# Altium schematic sheet BSPD_Simulation.SchDoc: QUTMS Shutdown V2 - BSPD_Simulation
size A4; Author: Jonn Dillon; Organization: QUT Motorsport; Address1: O-120; Address2: O Block; Address3: QUT Gardens Point; Address4: Brisbane, 4000; DocumentNumber: 10; SheetNumber: 10; SheetTotal: 13
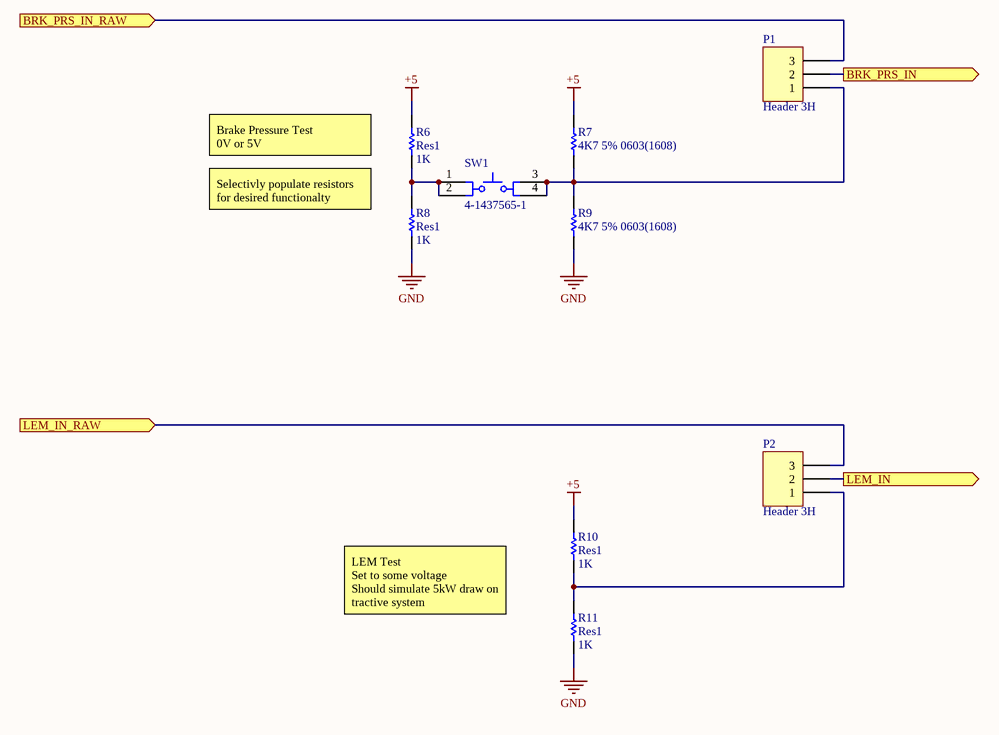
[diagram p0: BSPD_Simulation.SchDoc]

## Parts
P1  Header 3H  [HDR1X3H]
P2  Header 3H  [HDR1X3H]
R6  Res1  value 1K  [AXIAL-0.3]
R7  4K7 5% 0603(1608)  [RESC0603(1608)_N]
R8  Res1  value 1K  [AXIAL-0.3]
R9  4K7 5% 0603(1608)  [RESC0603(1608)_N]
R10  Res1  value 1K  [AXIAL-0.3]
R11  Res1  value 1K  [AXIAL-0.3]
SW1  4-1437565-1  [TECO-4-1437565-1_V]

## Ports
BRK_PRS_IN (out), BRK_PRS_IN_RAW (in), LEM_IN (out), LEM_IN_RAW (in)

## Nets
+5: R6.2 R7.2 R10.2
GND: R8.1 R9.1 R11.1
BRK_PRS_IN: P1.2 ; port BRK_PRS_IN
BRK_PRS_IN_RAW: P1.3 ; port BRK_PRS_IN_RAW
LEM_IN: P2.2 ; port LEM_IN
LEM_IN_RAW: P2.3 ; port LEM_IN_RAW
NetP1_1: P1.1 R7.1 R9.2 SW1.3 SW1.4
NetP2_1: P2.1 R10.1 R11.2
NetR6_1: R6.1 R8.2 SW1.1 SW1.2

## Notes on the sheet
- (near R6) Brake Pressure Test
  0V or 5V
- Selectivly populate resistors for desired functionalty
- LEM Test
  Set to some voltage
  Should simulate 5kW draw on tractive system
- Title
- Size:
- Date:
- A4
- Number:
- Time:
- Revision:
- Sheet
- of
- File:

## Library data of the parts
P1 P2 = Header 3H: Header, 3-Pin, Right Angle; LatestRevisionDate: 17-Jul-2002; LatestRevisionNote: Re-released for DXP Platform.; Publisher: Altium Limited
R6 R8 R10 R11 = Res1: Resistor; Published: 8-Jun-2000; LatestRevisionDate: 17-Jul-2002; LatestRevisionNote: Re-released for DXP Platform.; PackageReference: AXIAL-0.3; Publisher: Altium Limited; PackageDescription: Axial Device, Thru-Hole; 2 Leads; 0.3 in Pin Spacing
R7 R9 = CMP-1012-00090-1: 4K7 0.1W 5% 0603 (1608 Metric)  SMD; Case-Metric: 1608; Value: 4700.00 Ohm; Case-EIA: 0603; Tolerance: 5 %; Technology: SMT; Power: 0.1 W
SW1 = CMP-2000-05602-1: Tactile Switch, 50 mA, 12 VDC, -20 to 85 degC, 4-Pin SMD, RoHS, Bulk; Manufacturer: TEConnectivity/AMPBrand; Illumination Type: N/R; Maximum Contact Resistance: 100mOhm; Actuator Style: RoundButton; Actuator Length: 1.4mm; Contact Rating @ Voltage: 0.05@12VDCA; Maximum DC Voltage Rating: 12V; Body Orientation: Straight; Ground Terminal: No; Dielectric Strength: 500VAC; Operating Force: 1.57N; Electrical Life: 100000Cycle; Mechanical Life: N/A; Family: FSMJSMA; Contact Material: CopperAlloy; Type: N/A; RoHS: Yes; Pole Throw Configuration: N/A; Operating Temperature: -20to85C; Minimum Insulation Resistance: 100MOhm; Package Description: 4-Pin Surface Mount Device, Body 6 x 6 mm, Pitch 9.1 mm; Housing Material: N/A; Switch Configuration: N/A; Mounting: SurfaceMount,GullWing; Datasheet URL: https://datasheet.ciiva.com/14635/0900766b80912216-14635826.pdf; Packaging: Bulk; Base Material: N/A; Actuator Color: N/A; Dimension: 6x10x5.25mm; Contact Plating: Silver; Seal Location: N/A; Mounting Technology: SurfaceMount; Part No: 4-1437565-1; Seal Description: N/A; Maximum AC Voltage Rating: N/A; Datasheet Version: 04/2007; Manufacturer URL: http://www.te.com/; Package Reference: 4-1437565-1; Product Weight: N/A